# Altium schematic sheet Sheet_1_2022-06-01.schdoc
size 255 x 202 mm
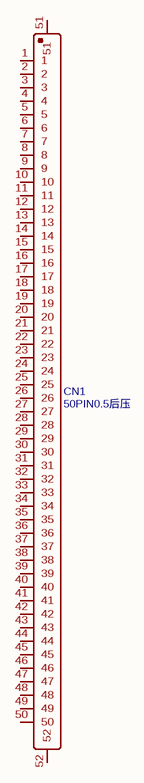
[diagram p0: Sheet_1_2022-06-01.schdoc]

## Parts
CN1  50PIN0.5后压  [FPC-SMD_50P-P0.50_CKMTW_F-FPC0M50P-C310-1]

## Nets

Not connected (* = marked no-connect by the designer): CN1 1 2 3 4 5 6 7 8 9 10 11 12 13 14 15 16 17 18 19 20 21 22 23 24 25 26 27 28 29 30 31 32 33 34 35 36 37 38 39 40 41 42 43 44 45 46 47 48 49 50 51 52

## Library data of the parts
CN1 = 50PIN0.5后压: BOM_Manufacturer: null; Contributor: LCSC; BOM_Supplier: LCSC; BOM_Supplier Part: C9900011403; BOM_Manufacturer Part: 50PIN0.5后压; BOM_JLCPCB Part Class: Extended Part; spicePre: C; spiceSymbolName: 50PIN0.5后压